# EAGLE design punktschweiß_pulser_mosfets (EAGLE 7.3.0)
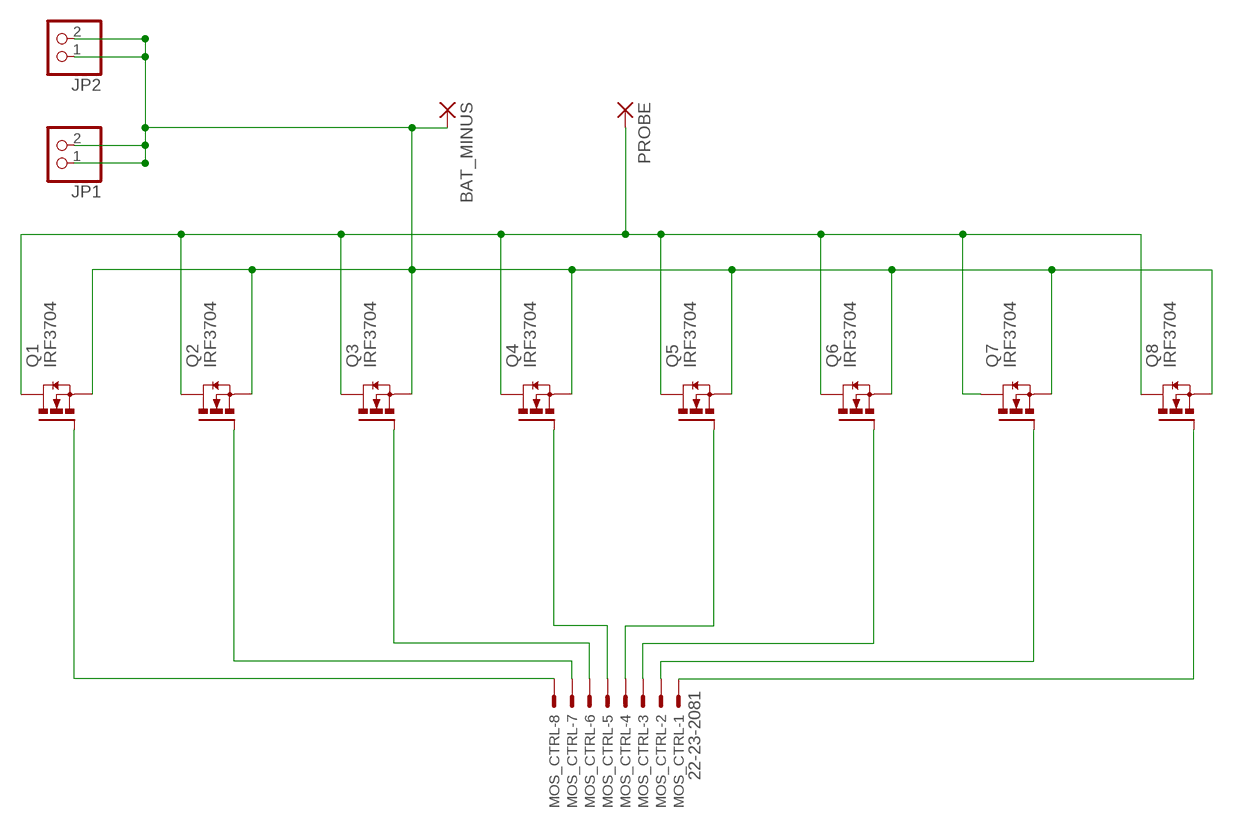
[diagram p0: schematic, sheet 1]

## Parts
BAT_MINUS  2,54/0,9  [2,54/0,9]
JP1  PINHD-1X2  [1X02]
JP2  PINHD-1X2  [1X02]
MOS_CTRL  22-23-2081  [22-23-2081]
PROBE  2,54/0,9  [2,54/0,9]
Q1  IRF3704  [TO220AH]
Q2  IRF3704  [TO220AH]
Q3  IRF3704  [TO220AH]
Q4  IRF3704  [TO220AH]
Q5  IRF3704  [TO220AH]
Q6  IRF3704  [TO220AH]
Q7  IRF3704  [TO220AH]
Q8  IRF3704  [TO220AH]

## Nets
N$1: MOS_CTRL.8 Q1.B(G)
N$2: MOS_CTRL.7 Q2.B(G)
N$3: MOS_CTRL.6 Q3.B(G)
N$4: MOS_CTRL.5 Q4.B(G)
N$5: MOS_CTRL.4 Q5.B(G)
N$6: MOS_CTRL.3 Q6.B(G)
N$7: MOS_CTRL.2 Q7.B(G)
N$8: MOS_CTRL.1 Q8.B(G)
N$9: BAT_MINUS.1(P) JP1.1 JP1.2 JP2.1 JP2.2 Q1.E(S) Q2.E(S) Q3.E(S) Q4.E(S) Q5.E(S) Q6.E(S) Q7.E(S) Q8.E(S)
N$11: PROBE.1(P) Q1.C(D) Q2.C(D) Q3.C(D) Q4.C(D) Q5.C(D) Q6.C(D) Q7.C(D) Q8.C(D)

## Library data of the parts
BAT_MINUS PROBE = wirepad:2,54/0,9: THROUGH-HOLE PAD
JP1 JP2 = pinhead:PINHD-1X2: PIN HEADER
MOS_CTRL = con-molex:22-23-2081: .100" (2.54mm) Center Header - 8 Pin; MF: MOLEX; MPN: 22-23-2081; OC_FARNELL: 1756826; OC_NEWARK: 01C7592
Q1-Q8 = transistor-power:IRF3704: SMPS MOSFET HEXFET® Power MOSFET Source: http://www.irf.com/product-info/datasheets/data/irf3704.pdf

## Board
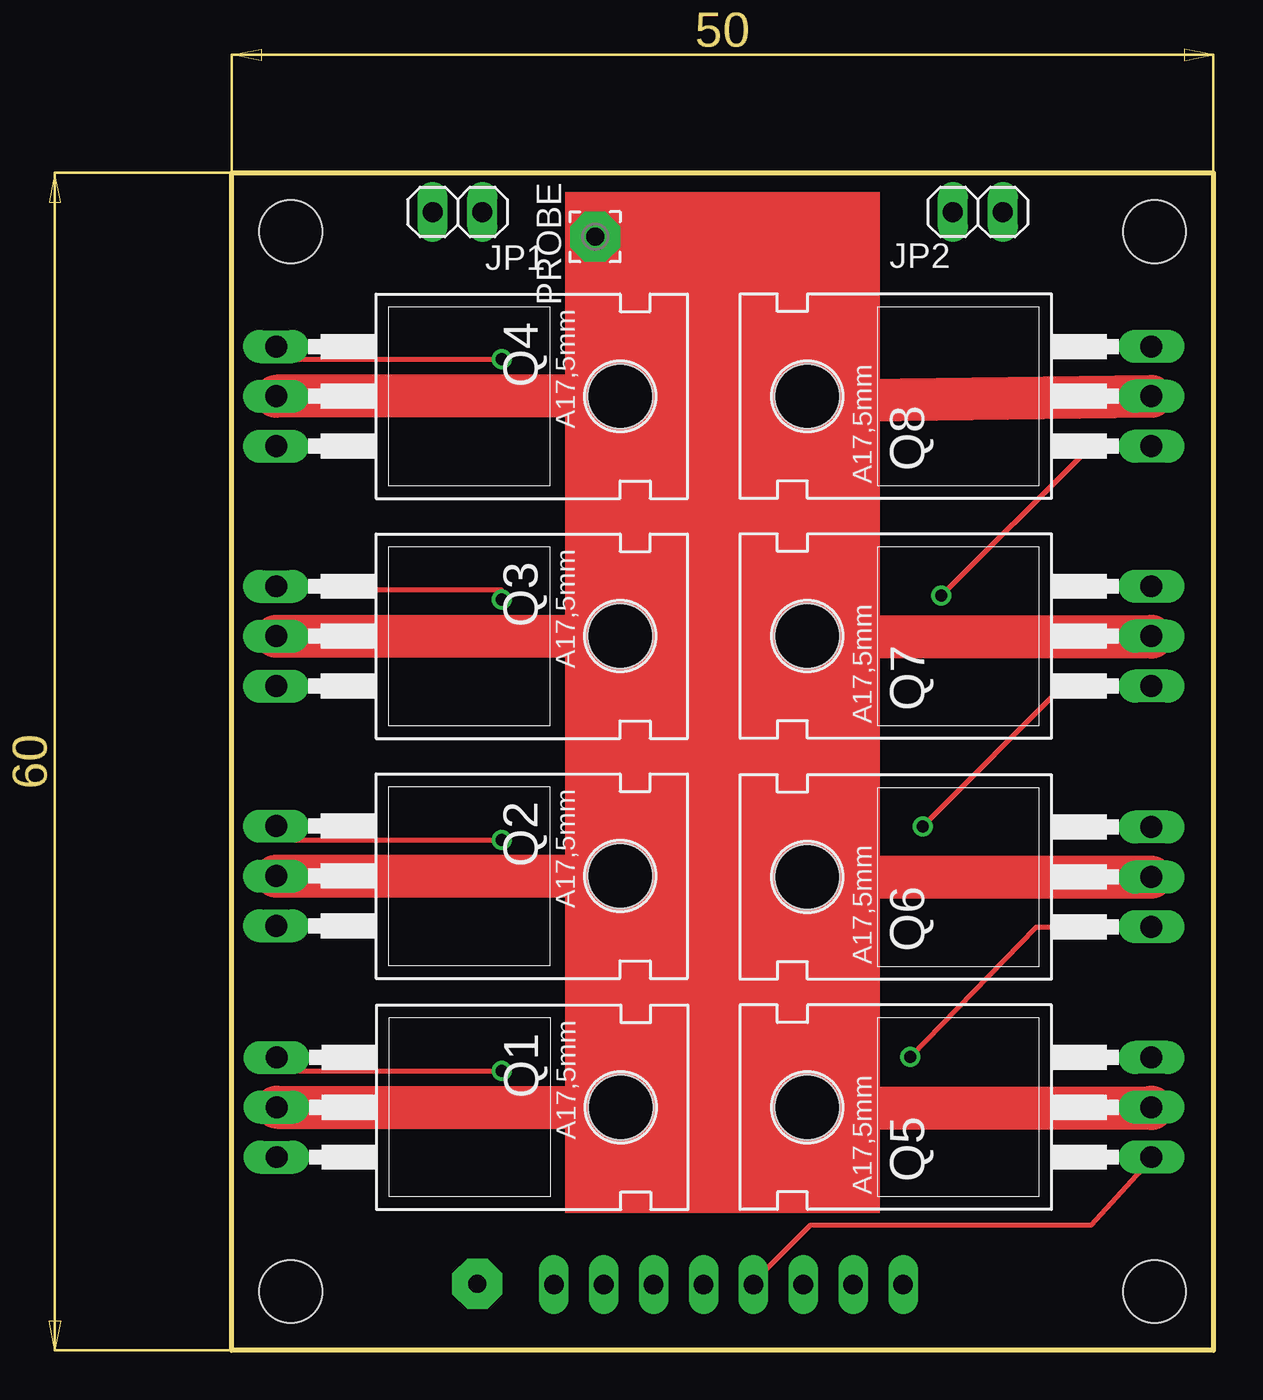
[diagram p1: board, top side]
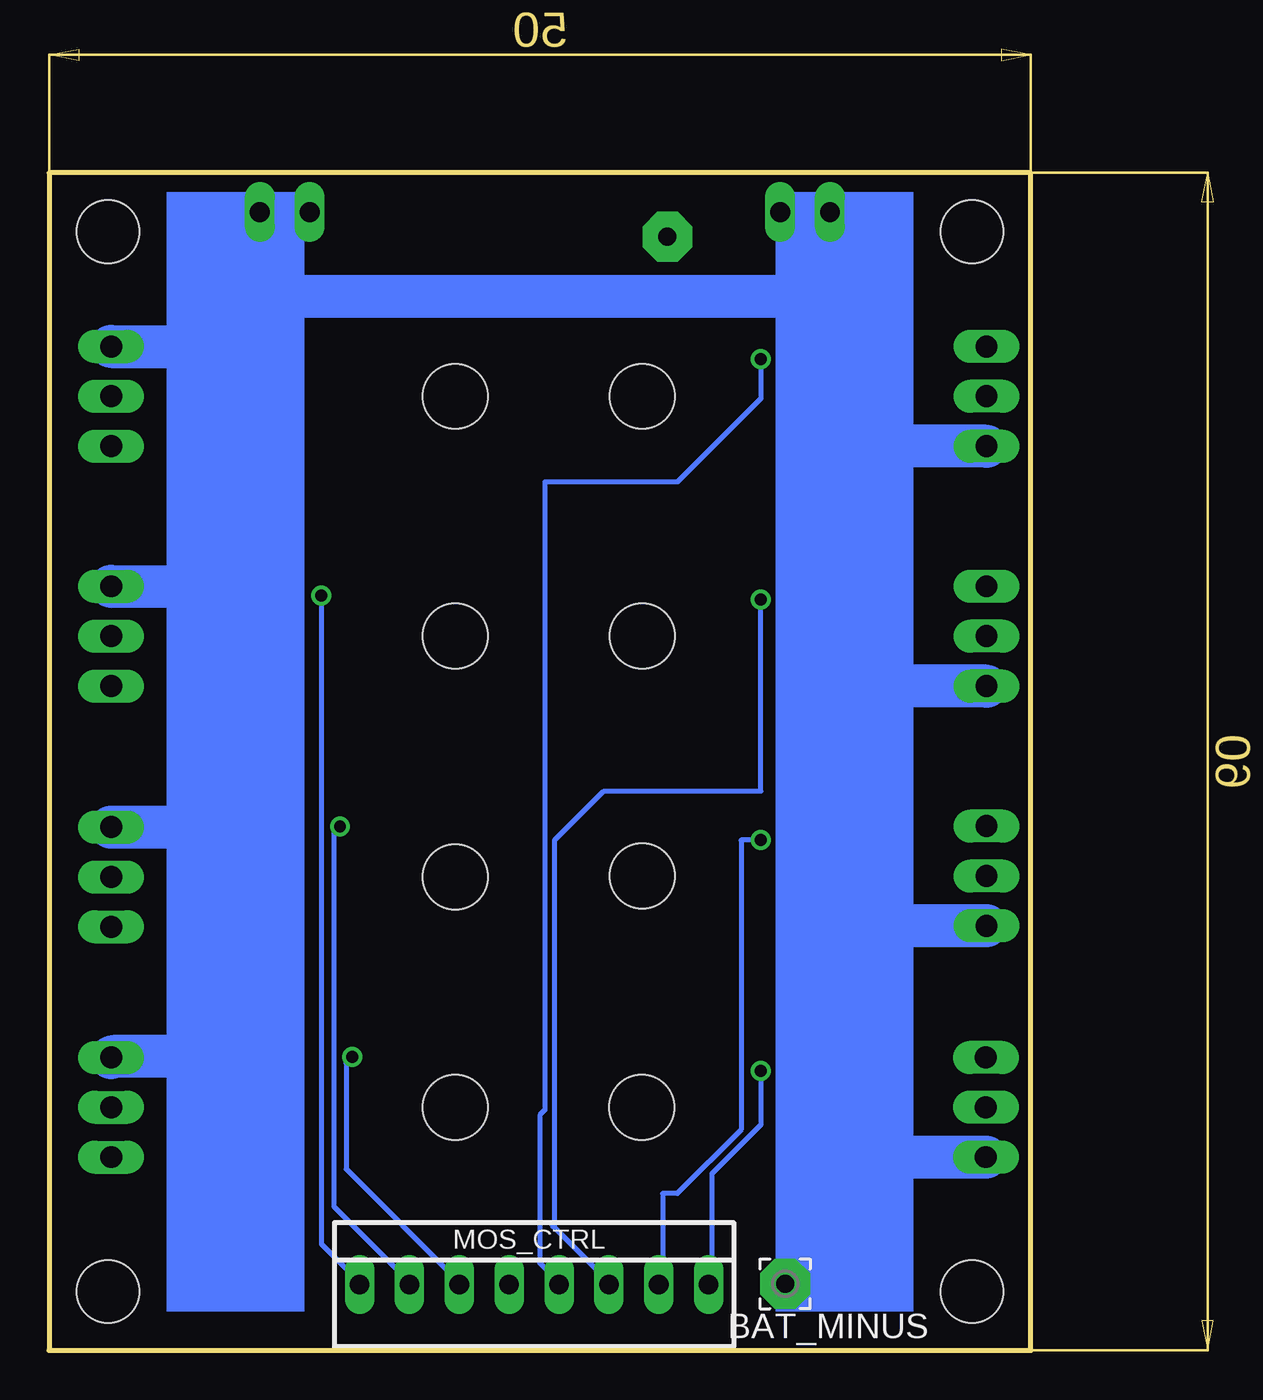
[diagram p2: board, bottom side, seen from below]

Size 50 x 60 mm. Coordinates in mm from the lower left corner, seen from the top.
Outline: 0,0 0,60 50,60 50,0 0,0
Copper layers (1*16): Top 0.035mm / dielectric 1.5mm / Bottom 0.035mm
Design rules "default": minimum track width 10mil, minimum drill 24mil, track to track 8mil, track to pad 8mil, pad to pad 8mil, via to via 8mil, smd to smd 8mil, copper to edge 40mil, drill to drill 8mil, minimum pad ring 10mil, minimum via ring 8mil, stop-mask expansion 4mil, vias tented up to drill 0mil, thermal gap 10mil
Holes 3.2 mm at 3,3 3,57 47,3 47,57

### Footprints (pad centres in the part's own frame; a part is rotated, then mirrored left to right if it is on the bottom)
2,54/0,9 = drill 0.914 pad 2.54 octagon: 1 0,0
1X02 = drill 1.016 long: 1 -1.27,0; 2 1.27,0
22-23-2081 = drill 1 long: 1 -8.89,0; 2 -6.35,0; 3 -3.81,0; 4 -1.27,0; 5 1.27,0; 6 3.81,0; 7 6.35,0; 8 8.89,0
TO220AH = drill 1.118 long: B -2.54,-6.35; C 0,-6.35; E 2.54,-6.35 | hole 3.302: 0,11.176

### Placement (x,y rotation side)
BAT_MINUS  12.51,3.4 180 bottom
JP1  11.5,58 0 top
JP2  38,58 0 top
MOS_CTRL  25.3,3.35 0 bottom
PROBE  18.51,56.74 270 top
Q1  8.64,12.39 270 top
Q2  8.61,24.17 270 top
Q3  8.61,36.39 270 top
Q4  8.61,48.61 270 top
Q5  40.49,12.39 90 top
Q6  40.49,24.12 90 top
Q7  40.49,36.39 90 top
Q8  40.49,48.61 90 top

### Tracks (layer width: path | path; a pad name or v marks a point on that pad's centre or on a via)
N$1  (via drill 0.61)
  Top 0.254: 2.48,14.64 Q1.B 2.5,14.75 2.5,14.25 v13.75,14.25
  Bottom 0.254: v13.75,14.25 13.75,11.5 16.25,9 16.25,3.5 MOS_CTRL.8
N$2  (via drill 0.61)
  Top 0.254: v13.75,26 2.5,26 2.5,26.5 Q2.B
  Bottom 0.254: v13.75,26 14.75,26 14.75,11.25 18,8 18.75,8 18.75,3.5 MOS_CTRL.7
N$3  (via drill 0.61)
  Top 0.254: v13.75,38.25 13.75,38.75 2.5,38.75 Q3.B
  Bottom 0.254: 24.39,6.38 24.25,6.25 | 24.25,6.25 21.53,3.52 MOS_CTRL.6 | v13.75,38.25 13.75,28.5 21.75,28.5 24.25,26 24.25,6.25
N$4  (via drill 0.61)
  Top 0.254: v13.75,50.5 2.5,50.5 2.5,51 Q4.B
  Bottom 0.254: 25.02,4.48 | 25.02,4.48 24.07,3.52 MOS_CTRL.5 | v13.75,50.5 13.75,48.5 18,44.25 24.75,44.25 24.75,12.25 25,12 25,4.5 25.02,4.48
N$5
  Top 0.254: MOS_CTRL.4 26.61,3.52 29.47,6.38 43.76,6.38 46.87,9.79 Q5.B
N$6  (via drill 0.61)
  Top 0.254: v34.55,14.96 40.95,21.56 46.67,21.56 Q6.B
  Bottom 0.254: v34.55,14.96 34.87,14.64 34.87,9.24 29.15,3.52 MOS_CTRL.3
N$7  (via drill 0.61)
  Top 0.254: v35.19,26.7 42.49,34.01 46.57,33.91 Q7.B
  Bottom 0.254: v35.19,26.7 35.5,26.39 35.5,7.33 31.69,3.52 MOS_CTRL.2
N$8  (via drill 0.61)
  Top 0.254: v36.14,38.45 43.44,45.75 46.67,46.05 Q8.B
  Bottom 0.254: v36.14,38.45 36.14,5.43 34.23,3.52 MOS_CTRL.1
N$9
  Bottom 0.254: 39.4,53.69 39.4,58 JP2.2 JP2.1 | 11.37,53.69 11.37,53.7 10.2,53.7 10.2,58 JP1.1 JP1.2
  Bottom 2.184: Q8.E 40.27,51.13 | 40.27,51.13 40.27,38.95 | 40.27,38.95 40.37,26.67 | 40.37,26.67 40.27,14.97 46.74,14.97 Q5.E | Q6.E 40.37,26.67 | Q7.E 40.27,38.95 | BAT_MINUS.1 11.37,3.4 11.37,9.85 | 11.37,9.85 11.37,21.63 | 11.37,21.63 11.37,33.85 | 11.37,33.85 11.37,46.07 | 11.37,46.07 11.37,53.69 39.4,53.69 40.27,53.69 40.27,51.13 | Q4.E 11.37,46.07 | Q3.E 11.37,33.85 | Q2.E 11.37,21.63 | Q1.E 11.37,9.85
N$11
  Top 2.184: Q5.C 46.84,12.33 30.42,12.33 30.32,24.1 | 30.32,24.1 30.42,36.34 | 30.42,36.34 30.42,48.39 | 30.42,48.39 Q8.C | Q6.C 46.74,24.1 30.32,24.1 | Q7.C 46.84,36.34 30.42,36.34 | 30.42,48.39 30.42,56.74 PROBE.1 18.36,56.74 18.36,48.61 | 18.36,48.61 Q4.C | Q1.C 18.36,12.39 18.36,24.17 | 18.36,24.17 18.36,36.39 | 18.36,36.39 18.36,48.61 | Q2.C 18.36,24.17 | Q3.C 18.36,36.39
(copper drawn outside any net)
  shapes: Bottom area x2, Top area x2